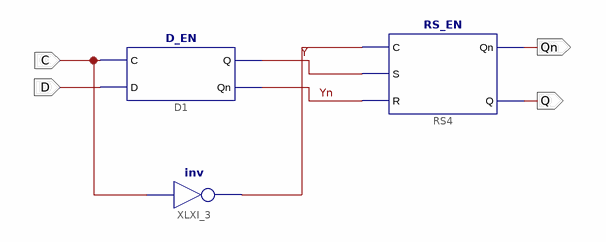
[diagram p0: schematic sheet 1]
// Xilinx ISE schematic D_Trig.sch (kintex7) as structural Verilog: 3 symbols, 4 ports
module D_Trig (
  input  C,
  input  D,
  output Qn,
  output Q
);

  wire XLXN_3, Y, Yn;

  D_EN D1 (.C(C), .D(D), .Q(Y), .Qn(Yn));
  RS_EN RS4 (.C(XLXN_3), .S(Y), .R(Yn), .Qn(Qn), .Q(Q));
  not XLXI_3 (XLXN_3, C);
endmodule
